# EAGLE design CoffretClimatiquePCBV3 (EAGLE 6.4)
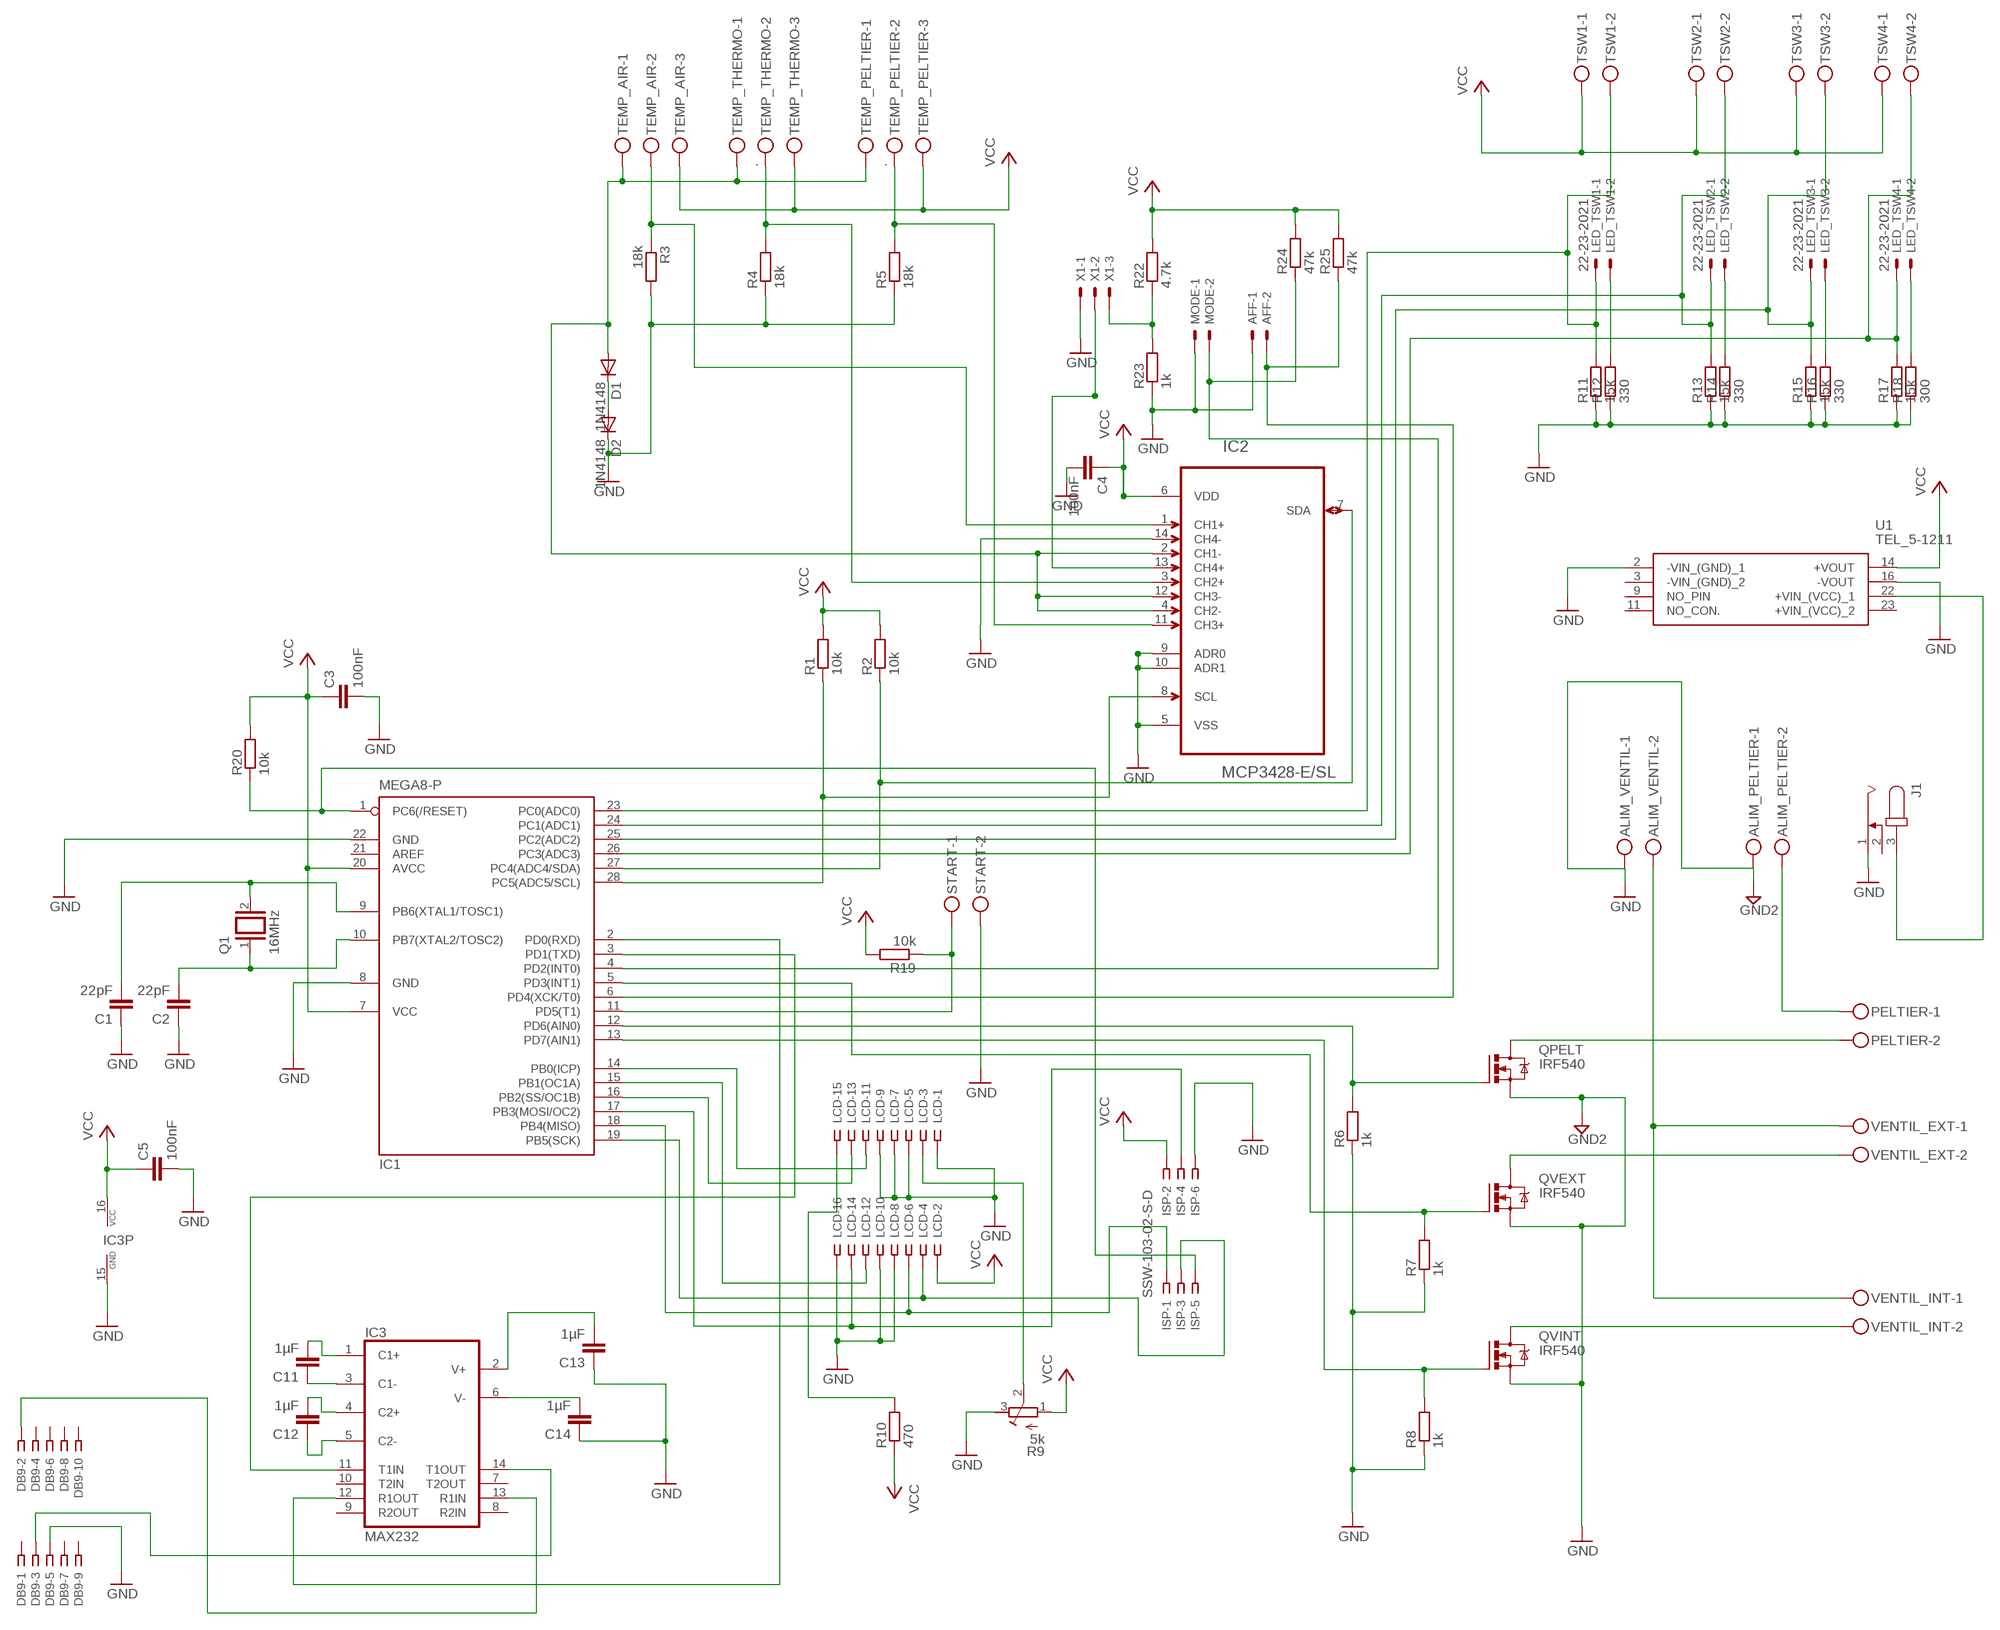
[diagram p0: schematic, sheet 1]

## Parts
AFF  22-23-2021  [22-23-2021]
ALIM_PELTIER  MKDSN1,5/2-5,08  [MKDSN1,5/2-5,08]
ALIM_VENTIL  MKDSN1,5/2-5,08  [MKDSN1,5/2-5,08]
C1  22pF  C-EU075-032X103  [C075-032X103]
C2  22pF  C-EU075-032X103  [C075-032X103]
C3  100nF  C-EUC1206  [C1206]
C4  100nF  C-EUC1206  [C1206]
C5  100nF  C-EUC1206  [C1206]
C11  1µF  C-EUC1206  [C1206]
C12  1µF  C-EUC1206  [C1206]
C13  1µF  C-EUC1206  [C1206]
C14  1µF  C-EUC1206  [C1206]
D1  1N4148  1N4148DO35-10  [DO35-10]
D2  1N4148  1N4148DO35-10  [DO35-10]
DB9  SSW-105-02-S-D  [SSW-105-02-S-D]
IC1  MEGA8-P  [DIL28-3]
IC2  MCP3428-E/SL  [SOIC127P600X175-14N]
IC3  MAX232  [DIL16]
ISP  SSW-103-02-S-D  [SSW-103-02-S-D]
J1  JACK-PLUG1  [SPC4078]
LCD  SSW-108-02-S-D  [SSW-108-02-S-D]
LED_TSW1  22-23-2021  [22-23-2021]
LED_TSW2  22-23-2021  [22-23-2021]
LED_TSW3  22-23-2021  [22-23-2021]
LED_TSW4  22-23-2021  [22-23-2021]
MODE  22-23-2021  [22-23-2021]
PELTIER  MKDSN1,5/2-5,08  [MKDSN1,5/2-5,08]
Q1  16MHz  XTAL/S  [QS]
QPELT  IRF540  [TO220BV]
QVEXT  IRF540  [TO220BV]
QVINT  IRF540  [TO220BV]
R1  10k  R-EU_R0805  [R0805]
R2  10k  R-EU_R0805  [R0805]
R3  18k  R-EU_0207/10  [0207/10]
R4  18k  R-EU_0207/10  [0207/10]
R5  18k  R-EU_0207/10  [0207/10]
R6  1k  R-EU_0207/10  [0207/10]
R7  1k  R-EU_0207/10  [0207/10]
R8  1k  R-EU_0207/10  [0207/10]
R9  5k  R-TRIMM64P  [RTRIM64P]
R10  470  R-EU_0207/10  [0207/10]
R11  15k  R-EU_0207/10  [0207/10]
R12  330  R-EU_0207/10  [0207/10]
R13  15k  R-EU_0207/10  [0207/10]
R14  330  R-EU_0207/10  [0207/10]
R15  15k  R-EU_0207/10  [0207/10]
R16  330  R-EU_0207/10  [0207/10]
R17  15k  R-EU_0207/10  [0207/10]
R18  300  R-EU_0207/10  [0207/10]
R19  10k  R-EU_0207/10  [0207/10]
R20  10k  R-EU_0207/10  [0207/10]
R22  4.7k  R-EU_0207/10  [0207/10]
R23  1k  R-EU_0207/10  [0207/10]
R24  47k  R-EU_0207/10  [0207/10]
R25  47k  R-EU_0207/10  [0207/10]
START  MKDSN1,5/2-5,08  [MKDSN1,5/2-5,08]
TEMP_AIR  MKDSN1,5/3-5,08  [MKDSN1,5/3-5,08]
TEMP_PELTIER  .  MKDSN1,5/3-5,08  [MKDSN1,5/3-5,08]
TEMP_THERMO  .  MKDSN1,5/3-5,08  [MKDSN1,5/3-5,08]
TSW1  MKDSN1,5/2-5,08  [MKDSN1,5/2-5,08]
TSW2  MKDSN1,5/2-5,08  [MKDSN1,5/2-5,08]
TSW3  MKDSN1,5/2-5,08  [MKDSN1,5/2-5,08]
TSW4  MKDSN1,5/2-5,08  [MKDSN1,5/2-5,08]
U1  TEL_5-1211  [TEL-5-1211]
VENTIL_EXT  MKDSN1,5/2-5,08  [MKDSN1,5/2-5,08]
VENTIL_INT  MKDSN1,5/2-5,08  [MKDSN1,5/2-5,08]
X1  22-23-2031  [22-23-2031]

## Nets
GND: AFF.1 ALIM_PELTIER.1 ALIM_VENTIL.1 C1.1 C2.1 C3.2 C4.2 C5.2 C13.1 C14.1 D2.C DB9.5 IC1.8(GND) IC1.22(GND) IC2.5(VSS) IC2.9(ADR0) IC2.10(ADR1) IC2.14(CH4-) IC3.15(GND) ISP.6 J1.1 LCD.1 LCD.5 LCD.7 LCD.8 LCD.9 LCD.10 LCD.16 MODE.1 QPELT.S QVEXT.S QVINT.S R3.2 R4.1 R5.1 R6.1 R7.1 R8.1 R9.3(E) R11.1 R12.1 R13.1 R14.1 R15.1 R16.1 R17.1 R18.1 R23.1 START.2 U1.2(-VIN_(GND)_1) U1.16(-VOUT) X1.1 ; supply symbol labelled GND2
N$1: C1.2 IC1.9(PB6(XTAL1/TOSC1)) Q1.2
N$2: C2.2 IC1.10(PB7(XTAL2/TOSC2)) Q1.1
N$3: J1.3 U1.22(+VIN_(VCC)_1)
N$4 [PWR]: QVEXT.D VENTIL_EXT.2
N$5: IC1.27(PC4(ADC4/SDA)) IC2.7(SDA) R2.1
N$6: IC1.28(PC5(ADC5/SCL)) IC2.8(SCL) R1.1
N$7: D1.C D2.A
N$8 [PWR]: ALIM_PELTIER.2 PELTIER.1
N$9: IC2.1(CH1+) R3.1 TEMP_AIR.2
N$10: IC2.3(CH2+) R4.2 TEMP_THERMO.2
N$11: IC2.11(CH3+) R5.2 TEMP_PELTIER.2
N$12: D1.A IC2.2(CH1-) IC2.4(CH2-) IC2.12(CH3-) TEMP_AIR.1 TEMP_PELTIER.1 TEMP_THERMO.1
N$13: IC2.13(CH4+) X1.2
N$14 [PWR]: PELTIER.2 QPELT.D
N$15: ALIM_VENTIL.2 VENTIL_EXT.1 VENTIL_INT.1
N$16: IC1.12(PD6(AIN0)) QPELT.G R6.2
N$17: IC1.5(PD3(INT1)) QVEXT.G R7.2
N$18: IC1.3(PD1(TXD)) IC3.11(T1IN)
N$19: QVINT.D VENTIL_INT.2
N$20: DB9.2 IC3.13(R1IN)
N$21: LCD.3 R9.2(S)
N$22: DB9.3 IC3.14(T1OUT)
N$23: LCD.15 R10.2
N$25: R22.1 R23.2 X1.3
N$30: IC1.4(PD2(INT0)) MODE.2 R24.1
N$31: AFF.2 IC1.6(PD4(XCK/T0)) R25.1
N$36: IC1.11(PD5(T1)) R19.1 START.1
N$37: IC1.2(PD0(RXD)) IC3.12(R1OUT)
N$38: IC1.13(PD7(AIN1)) QVINT.G R8.2
N$39: IC1.23(PC0(ADC0)) LED_TSW1.1 R11.2 TSW1.2
N$40: IC1.19(PB5(SCK)) ISP.3 LCD.4
N$41: IC1.24(PC1(ADC1)) LED_TSW2.1 R13.2 TSW2.2
N$42: IC1.18(PB4(MISO)) ISP.1 LCD.6
N$43: IC1.25(PC2(ADC2)) LED_TSW3.1 R15.2 TSW3.2
N$44: IC1.14(PB0(ICP)) LCD.11
N$45: IC1.26(PC3(ADC3)) LED_TSW4.1 R17.2 TSW4.2
N$46: IC1.15(PB1(OC1A)) LCD.12
N$47: IC1.16(PB2(SS/OC1B)) LCD.13
N$48: LED_TSW1.2 R12.2
N$49: LED_TSW2.2 R14.2
N$50: LED_TSW3.2 R16.2
N$51: LED_TSW4.2 R18.2
N$52: IC1.17(PB3(MOSI/OC2)) ISP.4 LCD.14
N$53: IC1.1(PC6(/RESET)) ISP.5 R20.1
N$54: C11.2 IC3.1(C1+)
N$55: C11.1 IC3.3(C1-)
N$56: C12.2 IC3.4(C2+)
N$57: C12.1 IC3.5(C2-)
N$58: C14.2 IC3.6(V-)
N$59: C13.2 IC3.2(V+)
VCC: C3.1 C4.1 C5.1 IC1.7(VCC) IC1.20(AVCC) IC2.6(VDD) IC3.16(VCC) ISP.2 LCD.2 R1.2 R2.2 R9.1(A) R10.1 R19.2 R20.2 R22.2 R24.2 R25.2 TEMP_AIR.3 TEMP_PELTIER.3 TEMP_THERMO.3 TSW1.1 TSW2.1 TSW3.1 TSW4.1 U1.14(+VOUT)
Unconnected: DB9.1 DB9.4 DB9.6 DB9.7 DB9.8 DB9.9 DB9.10 IC1.21(AREF) IC3.7(T2OUT) IC3.8(R2IN) IC3.9(R2OUT) IC3.10(T2IN) J1.2 U1.3(-VIN_(GND)_2) U1.9(NO_PIN) U1.11(NO_CON.) U1.23(+VIN_(VCC)_2)

## Library data of the parts
AFF LED_TSW1-LED_TSW4 MODE = con-molex:22-23-2021: .100" (2.54mm) Center Header - 2 Pin; MF: MOLEX; MPN: 22-23-2021; OC_FARNELL: 1462926; OC_NEWARK: 25C3832
ALIM_PELTIER ALIM_VENTIL PELTIER START TSW1-TSW4 VENTIL_EXT VENTIL_INT = con-phoenix-508:MKDSN1,5/2-5,08: MKDSN 1,5/ 2-5,08 Printklemme Nennstrom: 13,5 A Nennspannung: 250 V Rastermaß: 5,08 mm Polzahl: 2 Anschlussart: Schraubanschluss Montage: Löten Anschlussrichtung Leiter/Platine: 0 ° Artikelnummer: 1729128 Source: http://eshop.phoenixcontact.com .. 1729128.pdf; MPN: MKDSN 1,5/2-5.08; OC_FARNELL: 1792903; OC_NEWARK: 30M2397
C1-C5 C11-C14 = rcl:C-EU: CAPACITOR, European symbol
D1 D2 = diode:1N4148: DIODE high speed (Philips)
DB9 = con-samtec:SSW-105-02-S-D: THROUGH-HOLE .025" SQ POST SOCKET Source: Samtec SSW.pdf; MPN: SSW-105-02-S-D; OC_FARNELL: unknown; OC_NEWARK: 11P9398
IC1 = atmel:MEGA8-P: MICROCONTROLLER 8 Kbytes FLASH, 1 kbytes SRAM, 512 bytes EEPROM, USART, 4-channel 10 bit ADC, 2-channel 8 bit ADC Pin compatible with Atmega48, ATMega88, ATMega168 Source: avr.lbr; OC_FARNELL: unknown; OC_NEWARK: unknown
IC2 = Microchip_By_element14_Batch_1:MCP3428-E/SL: Analog-to-Digital Converter; MPN: MCP3428-E/SL; OC_FARNELL: 1825014; OC_NEWARK: 52R9962; PACKAGE: SOIC-14; SUPPLIER: Microchip
IC3 = maxim:MAX232: RS232 TRANSEIVER; MF: MAXIM; MPN: MAX232ACPE+; OC_FARNELL: 9723773; OC_NEWARK: 68K4544
ISP = con-samtec:SSW-103-02-S-D: THROUGH-HOLE .025" SQ POST SOCKET Source: Samtec SSW.pdf; MPN: SSW-103-02-S-D; OC_FARNELL: unknown; OC_NEWARK: 11P9365
J1 = con-jack:JACK-PLUG: DC POWER JACK Power Jack, DC, Right Angle, Through Hole, Rated 5A at 16VDC, PC Terminals Distributor: Farnell (www.Farnell.de) Drawing: 84N1161.pdf / 84N1162.pdf Manufacturer: SPC Technology (www.spctechnology.com) Type: SPC4077 / SPC 4078; OC_FARNELL: unknown; OC_NEWARK: unknown
LCD = con-samtec:SSW-108-02-S-D: THROUGH-HOLE .025" SQ POST SOCKET Source: Samtec SSW.pdf; MPN: SSW-108-02-S-D; OC_FARNELL: unknown; OC_NEWARK: 85K7646
Q1 = special:XTAL/S: CRYSTAL
QPELT QVEXT QVINT = transistor-power:IRF540: HEXFET Power MOSFET
R1-R8 R10-R20 R22-R25 = rcl:R-EU_: RESISTOR, European symbol
R9 = rcl:R-TRIMM: Trimm resistor
TEMP_AIR TEMP_PELTIER TEMP_THERMO = con-phoenix-508:MKDSN1,5/3-5,08: MKDSN 1,5/ 3-5,08 Printklemme Nennstrom: 13,5 A Nennspannung: 250 V Rastermaß: 5,08 mm Polzahl: 3 Anschlussart: Schraubanschluss Montage: Löten Anschlussrichtung Leiter/Platine: 0 ° Artikelnummer: 1729131 Source: http://eshop.phoenixcontact.com .. 1729131.pdf; MPN: SMKDSN1,5/3-5,08; OC_FARNELL: 1792904; OC_NEWARK: 70R0299
U1 = TEL_5-1211:TEL_5-1211: TEL5 DC-DC converter,9-18Vin 5V 5W TRACOPOWER Isolated DC-DC Converter, Vin 9 18 V dc, Vout 5V dc, I/O isolation 1500V dc Source: Datasheet <http://assets.tracopower.com/20170802134720/TEL5/documents/tel5-datasheet.pdf>; ALLIED_NUMBER: 70421183; ALLIED_PRICE-STOCK: https://www.alliedelec.com/tracopower-tel-5-1211/70421183/; DESCRIPTION: TEL5 DC-DC converter,9-18Vin 5V 5W TRACOPOWER Isolated DC-DC Converter, Vin 9 18 V dc, Vout 5V dc, I/O isolation 1500V dc; HEIGHT: mm; MANUFACTURER_NAME: Traco Power; MANUFACTURER_PART_NUMBER: TEL 5-1211; MOUSER_PART_NUMBER: 495-TEL-5-1211; MOUSER_PRICE-STOCK: https://www.mouser.com/Search/Refine.aspx?Keyword=495-TEL-5-1211; RS_PART_NUMBER: 4667051; RS_PRICE-STOCK: https://uk.rs-online.com/web/p/products/4667051
X1 = con-molex:22-23-2031: .100" (2.54mm) Center Header - 3 Pin; MF: MOLEX; MPN: 22-23-2031; OC_FARNELL: 1462950; OC_NEWARK: 30C0862

## Net classes
1 PWR: width 2 mm

## Board
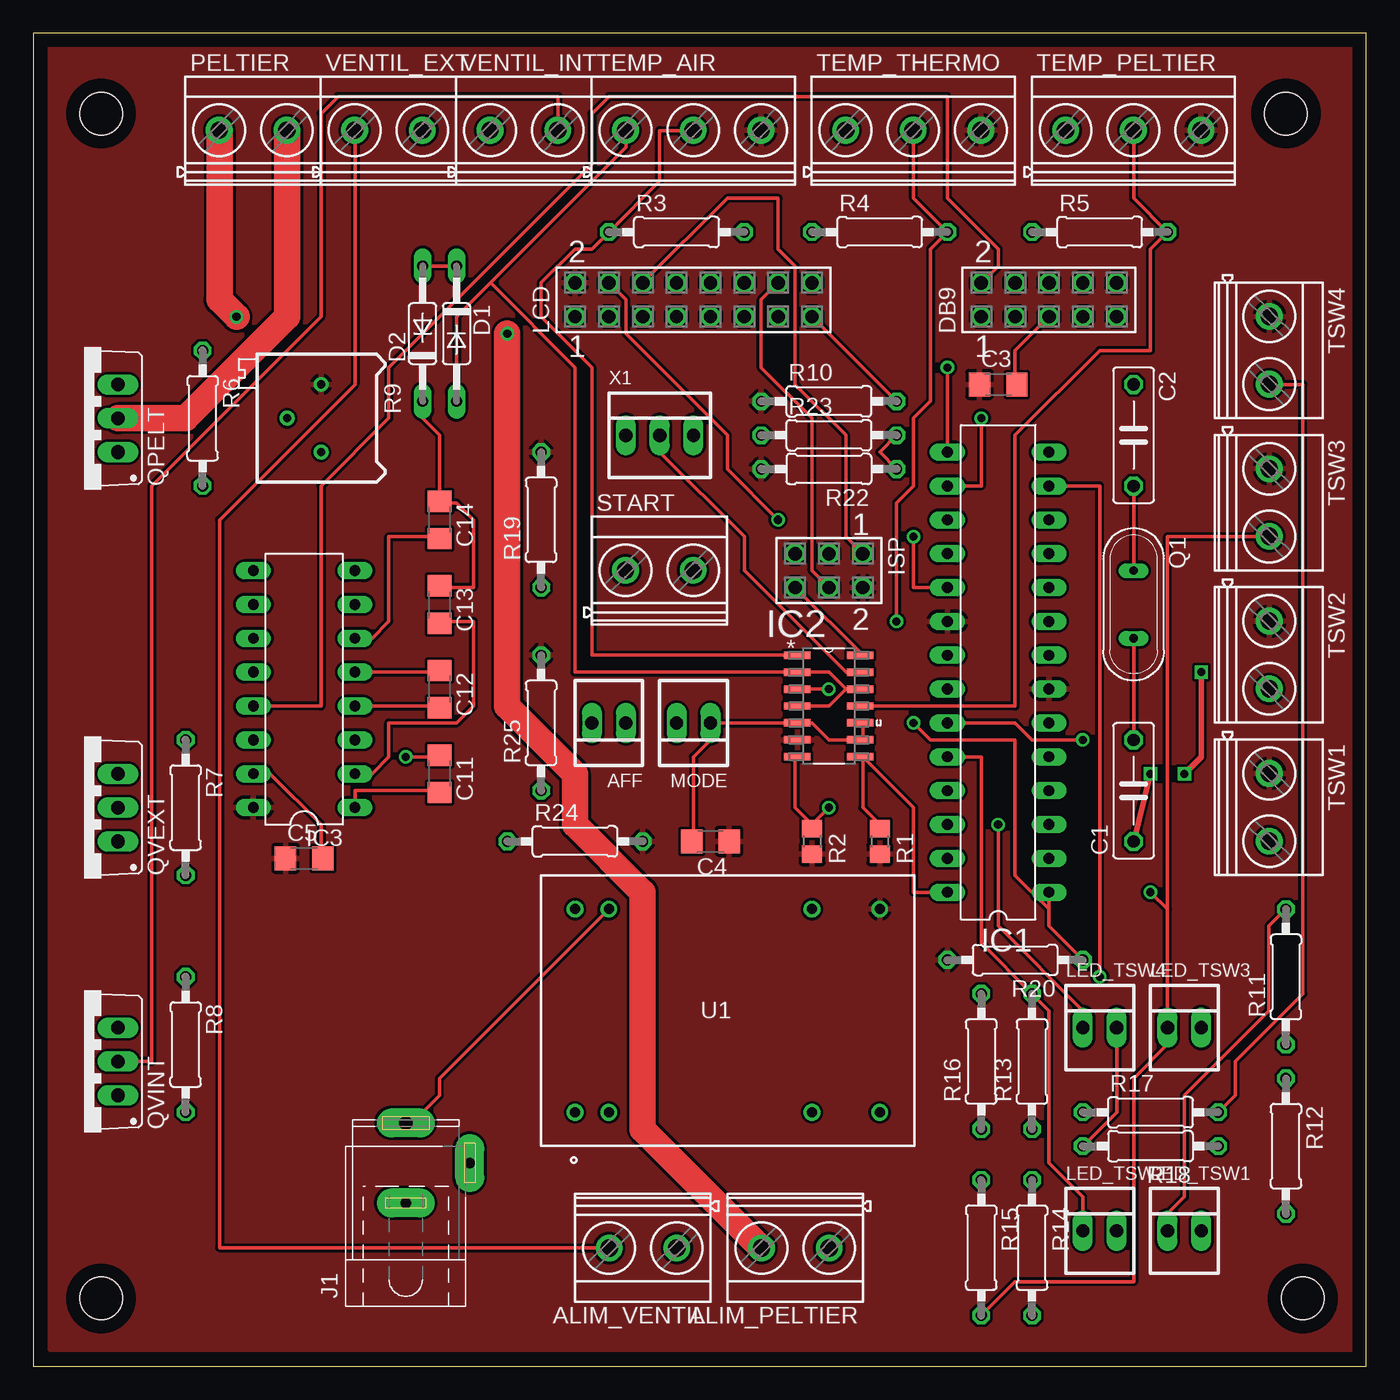
[diagram p1: board, top side]
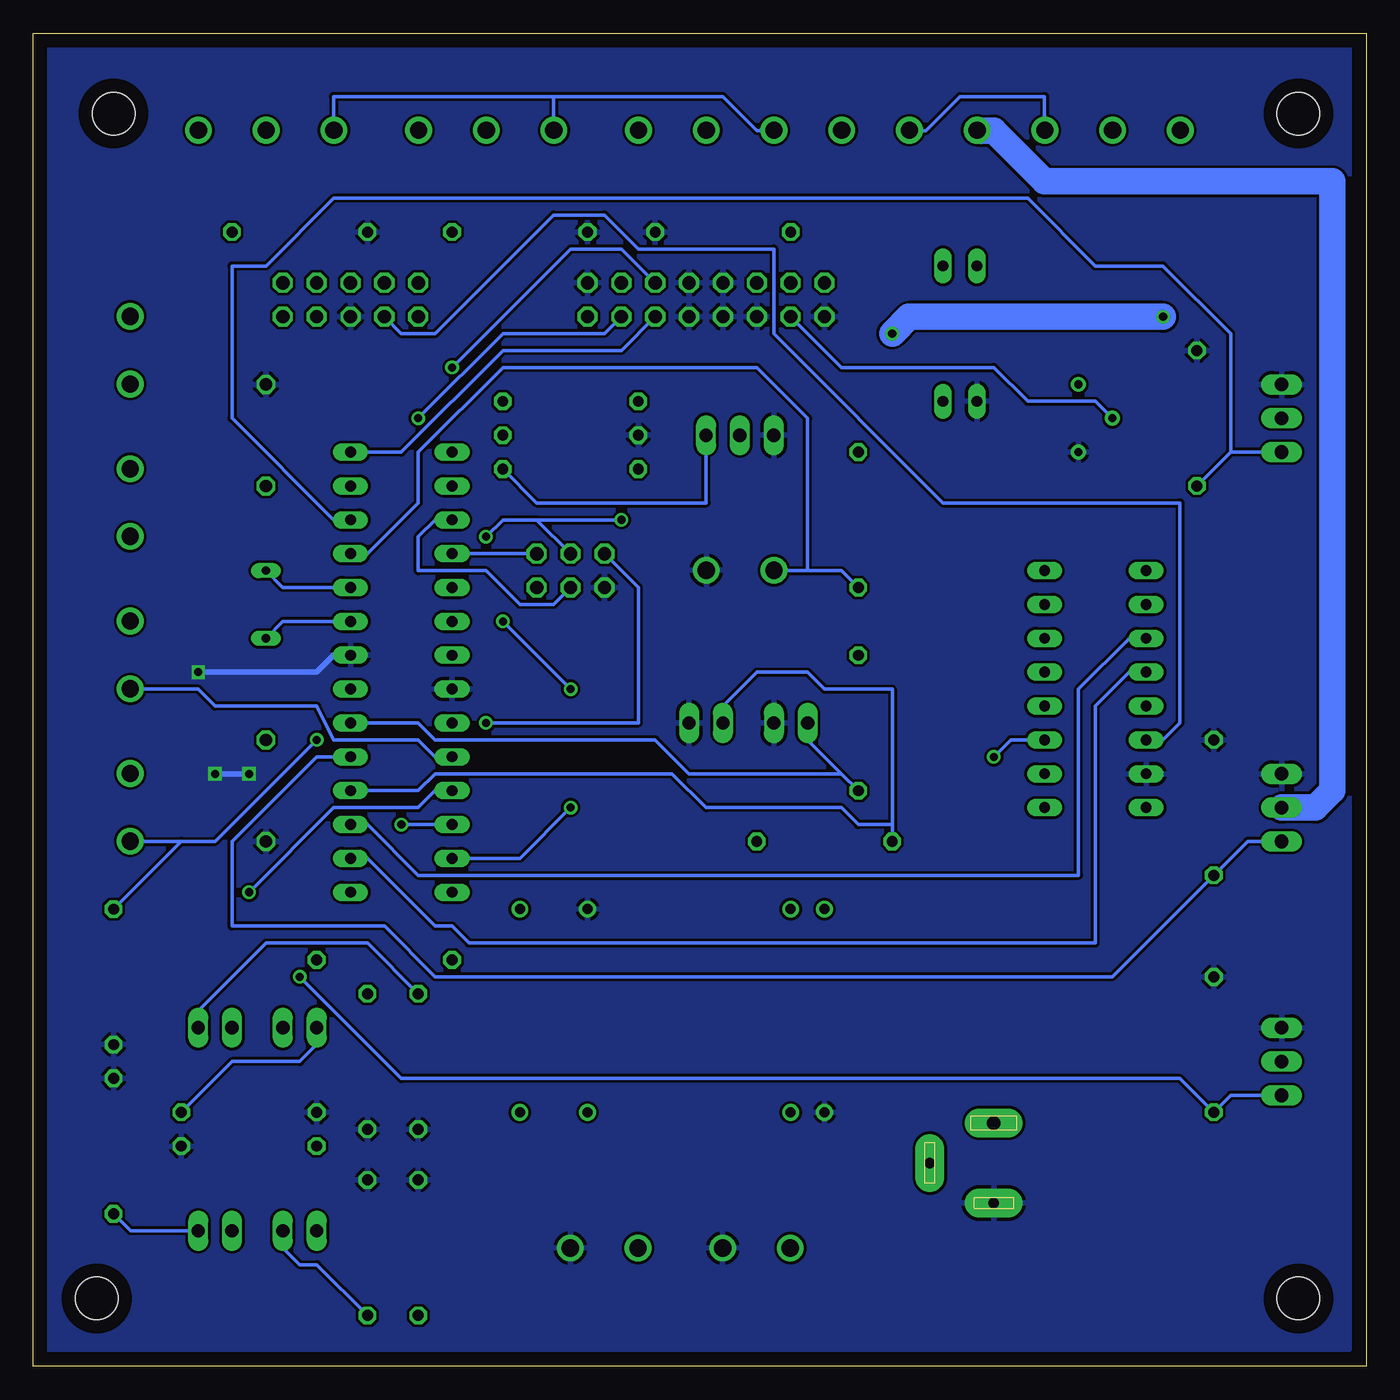
[diagram p2: board, bottom side, seen from below]

Size 100 x 100 mm. Coordinates in mm from the lower left corner, seen from the top.
Outline: 0,0 100,0 100,100 0,100 0,0
Copper layers (1*16): Top 0.035mm / dielectric 1.5mm / Bottom 0.035mm
Design rules "default *": minimum track width 10mil, minimum drill 24mil, track to track 8mil, track to pad 8mil, pad to pad 8mil, via to via 8mil, smd to smd 8mil, copper to edge 40mil, drill to drill 8mil, minimum pad ring 10mil, minimum via ring 8mil, stop-mask expansion 4mil, vias tented up to drill 0mil, thermal gap 10mil
Holes 3.2 mm at 95.25,5.08 5.08,5.08 93.98,93.98 5.08,93.98

### Footprints (pad centres in the part's own frame; a part is rotated, then mirrored left to right if it is on the bottom)
22-23-2021 = drill 1 long: 1 -1.27,0; 2 1.27,0
MKDSN1,5/2-5,08 = drill 1.3 pad 2: 1 -2.561,0.025; 2 2.519,0.025
C075-032X103 = drill 0.914 octagon: 1 -3.81,0; 2 3.81,0
C1206 = smd 1.6 x 1.8: 1 -1.4,0; 2 1.4,0
DO35-10 = drill 0.813 long: A 5.08,0; C -5.08,0
SSW-105-02-S-D = drill 1 pad 1.5 octagon: 1 -5.08,-1.27; 2 -5.08,1.27; 3 -2.54,-1.27; 4 -2.54,1.27; 5 0,-1.27; 6 0,1.27; 7 2.54,-1.27; 8 2.54,1.27; 9 5.08,-1.27; 10 5.08,1.27
DIL28-3 = drill 0.813 long: 1 -16.51,-3.81; 2 -13.97,-3.81; 3 -11.43,-3.81; 4 -8.89,-3.81; 5 -6.35,-3.81; 6 -3.81,-3.81; 7 -1.27,-3.81; 8 1.27,-3.81; 9 3.81,-3.81; 10 6.35,-3.81; 11 8.89,-3.81; 12 11.43,-3.81; 13 13.97,-3.81; 14 16.51,-3.81; 15 16.51,3.81; 16 13.97,3.81; 17 11.43,3.81; 18 8.89,3.81; 19 6.35,3.81; 20 3.81,3.81; 21 1.27,3.81; 22 -1.27,3.81; 23 -3.81,3.81; 24 -6.35,3.81; 25 -8.89,3.81; 26 -11.43,3.81; 27 -13.97,3.81; 28 -16.51,3.81
SOIC127P600X175-14N = smd 1.981 x 0.559: 1 -2.362,3.81; 2 -2.362,2.54; 3 -2.362,1.27; 4 -2.362,0; 5 -2.362,-1.27; 6 -2.362,-2.54; 7 -2.362,-3.81; 8 2.362,-3.81; 9 2.362,-2.54; 10 2.362,-1.27; 11 2.362,0; 12 2.362,1.27; 13 2.362,2.54; 14 2.362,3.81
DIL16 = drill 0.813 long: 1 -8.89,-3.81; 2 -6.35,-3.81; 3 -3.81,-3.81; 4 -1.27,-3.81; 5 1.27,-3.81; 6 3.81,-3.81; 7 6.35,-3.81; 8 8.89,-3.81; 9 8.89,3.81; 10 6.35,3.81; 11 3.81,3.81; 12 1.27,3.81; 13 -1.27,3.81; 14 -3.81,3.81; 15 -6.35,3.81; 16 -8.89,3.81
SSW-103-02-S-D = drill 1 pad 1.5 octagon: 1 -2.54,-1.27; 2 -2.54,1.27; 3 0,-1.27; 4 0,1.27; 5 2.54,-1.27; 6 2.54,1.27
SPC4078 = drill 0.8 pad 2.184 long: 1 -3,0; 2 0,-4.8 | drill 1 pad 2.184 long: 3 3,0
SSW-108-02-S-D = drill 1 pad 1.5 octagon: 1 -8.89,-1.27; 2 -8.89,1.27; 3 -6.35,-1.27; 4 -6.35,1.27; 5 -3.81,-1.27; 6 -3.81,1.27; 7 -1.27,-1.27; 8 -1.27,1.27; 9 1.27,-1.27; 10 1.27,1.27; 11 3.81,-1.27; 12 3.81,1.27; 13 6.35,-1.27; 14 6.35,1.27; 15 8.89,-1.27; 16 8.89,1.27
QS = drill 0.61 long: 1 -2.54,0; 2 2.54,0
TO220BV = drill 1.016 long: D 0,-2.54; G -2.54,-2.54; S 2.54,-2.54
R0805 = smd 1.3 x 1.5: 1 -0.95,0; 2 0.95,0
0207/10 = drill 0.813 octagon: 1 -5.08,0; 2 5.08,0
RTRIM64P = drill 0.61: 1 0,-2.54; 2 2.54,0; 3 0,2.54
MKDSN1,5/3-5,08 = drill 1.3 pad 2: 1 -7.641,0.025; 2 -2.561,0.025; 3 2.519,0.025
TEL-5-1211 = drill 0.75 pad 1.25: 2 2.54,-7.62; 3 5.08,-7.62; 9 20.32,-7.62; 11 25.4,-7.62; 14 25.4,7.62; 16 20.32,7.62; 22 5.08,7.62; 23 2.54,7.62
22-23-2031 = drill 1 long: 1 -2.54,0; 2 0,0; 3 2.54,0

### Placement (x,y rotation side)
AFF  43.18,48.26 180 top
ALIM_PELTIER  57.15,8.89 180 top
ALIM_VENTIL  45.72,8.89 180 top
C1  82.55,43.18 90 top
C2  82.55,69.85 270 top
C3  72.39,73.66 0 top
C4  50.8,39.37 180 top
C5  20.32,38.1 0 top
C11  30.48,44.45 270 top
C12  30.48,50.8 270 top
C13  30.48,57.15 270 top
C14  30.48,63.5 270 top
D1  31.75,77.47 270 top
D2  29.21,77.47 90 top
DB9  76.2,80.01 0 top
IC1  72.39,52.07 90 top
IC2  59.69,49.53 0 top
IC3  20.32,50.8 90 top
ISP  59.69,59.69 180 top
J1  27.94,15.24 90 top
LCD  49.53,80.01 0 top
LED_TSW1  86.36,10.16 0 top
LED_TSW2  80.01,10.16 0 top
LED_TSW3  86.36,25.4 0 top
LED_TSW4  80.01,25.4 0 top
MODE  49.53,48.26 180 top
PELTIER  16.51,92.71 0 top
Q1  82.55,57.15 270 top
QPELT  3.81,71.12 90 top
QVEXT  3.81,41.91 90 top
QVINT  3.81,22.86 90 top
R1  63.5,39.37 270 top
R2  58.42,39.37 270 top
R3  48.26,85.09 0 top
R4  63.5,85.09 0 top
R5  80.01,85.09 0 top
R6  12.7,71.12 270 top
R7  11.43,41.91 270 top
R8  11.43,24.13 270 top
R9  21.59,71.12 180 top
R10  59.69,72.39 0 top
R11  93.98,29.21 90 top
R12  93.98,16.51 270 top
R13  74.93,22.86 90 top
R14  74.93,8.89 270 top
R15  71.12,8.89 270 top
R16  71.12,22.86 90 top
R17  83.82,19.05 0 top
R18  83.82,16.51 180 top
R19  38.1,63.5 90 top
R20  73.66,30.48 180 top
R22  59.69,67.31 180 top
R23  59.69,69.85 0 top
R24  40.64,39.37 0 top
R25  38.1,48.26 90 top
START  46.99,59.69 0 top
TEMP_AIR  52.07,92.71 0 top
TEMP_PELTIER  85.09,92.71 0 top
TEMP_THERMO  68.58,92.71 0 top
TSW1  92.71,41.91 270 top
TSW2  92.71,53.34 270 top
TSW3  92.71,64.77 270 top
TSW4  92.71,76.2 270 top
U1  38.1,26.67 0 top
VENTIL_EXT  26.67,92.71 0 top
VENTIL_INT  36.83,92.71 0 top
X1  46.99,69.85 0 top

### Tracks (layer width: path | path; a pad name or v marks a point on that pad's centre or on a via)
GND  (via drill 0.6)
  Top 0.254: C13.1 30.48,58.42 33.02,58.42 33.02,63.5 31.75,64.77 30.48,64.77 C14.1 30.48,69.85 29.21,71.12 D2.C | IC2.10 62.23,48.26 62.23,46.99 IC2.9 59.69,46.99 58.42,48.26 IC2.5 MODE.1 50.8,46.99 49.53,45.72 49.53,39.37 C4.2 | IC3.15 17.78,44.45 21.59,40.64 21.59,38.1 C5.2 | DB9.5 73.66,76.2 73.66,73.66 C3.2 | ISP.6 62.23,53.34 IC2.14
  Top 0.406: C1.1 v83.82,44.45 | v86.36,44.45 87.63,45.72 v87.63,52.07
  Bottom 0.406: v83.82,44.45 v86.36,44.45 | v87.63,52.07 78.74,52.07 77.47,53.34 IC1.8
  pour Bottom: 1.27,99.06 99.06,99.06 99.06,1.27 1.27,1.27
N$1
  Top 0.254: Q1.2 C1.2
  Bottom 0.254: Q1.2 81.28,55.88 IC1.9
N$2
  Top 0.254: Q1.1 C2.2
  Bottom 0.254: Q1.1 81.28,58.42 IC1.10
N$3
  Top 0.254: U1.22 30.48,21.59 30.48,20.32 27.94,17.78 J1.3
N$4
  Bottom 2: QVEXT.D 3.81,41.91 2.54,43.18 2.54,88.9 24.13,88.9 27.94,92.71 29.21,92.71 VENTIL_EXT.2
N$5  (via drill 0.61)
  Top 0.254: 58.42,40.64 57.15,41.91 57.15,45.72 IC2.7 | 58.42,40.64 v59.69,41.91 | 58.42,40.64 R2.1
  Bottom 0.254: IC1.27 63.5,38.1 v59.69,41.91
N$6
  Top 0.254: 62.23,45.72 62.23,41.91 63.5,40.64 R1.1 | IC1.28 66.04,35.56 66.04,41.91 62.23,45.72 | 62.23,45.72 IC2.8
N$7
  Top 0.254: D1.C D2.A
N$8  (via drill 0.61)
  Top 2: v35.56,77.47 35.56,49.53 40.64,44.45 40.64,40.64 45.72,35.56 45.72,17.78 54.61,8.89 ALIM_PELTIER.2 | v15.24,78.74 13.97,80.01 13.97,92.71 PELTIER.1
  Bottom 2: v35.56,77.47 34.29,78.74 v15.24,78.74
N$9
  Top 0.254: IC2.1 41.91,53.34 41.91,74.93 38.1,78.74 38.1,81.28 40.64,83.82 41.91,83.82 R3.1 46.99,88.9 46.99,92.71 49.53,92.71 TEMP_AIR.2
N$10  (via drill 0.61)
  Top 0.254: v59.69,50.8 IC2.3 57.15,50.8 | v64.77,55.88 64.77,64.77 66.04,66.04 66.04,71.12 67.31,72.39 67.31,83.82 R4.2 66.04,87.63 66.04,92.71 TEMP_THERMO.2
  Bottom 0.254: v64.77,55.88 v59.69,50.8
N$11
  Top 0.254: IC2.11 73.66,49.53 73.66,69.85 80.01,76.2 83.82,76.2 83.82,83.82 R5.2 82.55,87.63 82.55,92.71 TEMP_PELTIER.2
N$12
  Top 0.254: 60.96,50.8 59.69,49.53 IC2.4 57.15,49.53 | 60.96,50.8 IC2.12 62.23,50.8 | 60.96,50.8 59.69,52.07 IC2.2 57.15,52.07 40.64,52.07 40.64,74.93 34.29,81.28 | D1.A 31.75,78.74 34.29,81.28 | 34.29,81.28 44.45,91.44 44.45,92.71 TEMP_AIR.1
  Bottom 0.254: 60.96,95.25 60.96,92.71 TEMP_THERMO.1 | 60.96,95.25 48.26,95.25 45.72,92.71 44.45,92.71 TEMP_AIR.1 | 60.96,95.25 77.47,95.25 77.47,92.71 TEMP_PELTIER.1
N$13
  Top 0.254: X1.2 46.99,68.58 53.34,62.23 53.34,59.69 60.96,52.07 IC2.13 62.23,52.07
N$14
  Top 2: QPELT.D 11.43,71.12 19.05,78.74 19.05,92.71 PELTIER.2
N$15
  Top 0.254: ALIM_VENTIL.2 43.18,8.89 13.97,8.89 13.97,63.5 24.13,73.66 24.13,92.71 VENTIL_EXT.1
  Bottom 0.254: VENTIL_EXT.1 24.13,92.71 24.13,95.25 30.48,95.25 33.02,92.71 34.29,92.71 VENTIL_INT.1
N$16
  Bottom 0.254: 10.16,68.58 R6.2 | QPELT.G 10.16,68.58 | IC1.12 77.47,63.5 85.09,71.12 85.09,82.55 82.55,82.55 77.47,87.63 25.4,87.63 20.32,82.55 15.24,82.55 10.16,77.47 10.16,68.58
N$17
  Bottom 0.254: QVEXT.G 8.89,39.37 R7.2 19.05,29.21 69.85,29.21 73.66,33.02 85.09,33.02 85.09,39.37 78.74,45.72 IC1.5
N$18
  Bottom 0.254: IC3.11 17.78,54.61 21.59,50.8 21.59,36.83 71.12,36.83 74.93,40.64 IC1.3
N$19
  Top 0.254: QVINT.D 8.89,22.86 8.89,66.04 21.59,78.74 21.59,93.98 22.86,95.25 39.37,95.25 39.37,92.71 VENTIL_INT.2
N$20
  Top 0.254: IC3.13 21.59,49.53 21.59,66.04 26.67,71.12 26.67,74.93 41.91,90.17 41.91,93.98 43.18,95.25 68.58,95.25 68.58,87.63 72.39,83.82 72.39,82.55 DB9.2
N$21
  Bottom 0.254: R9.2 20.32,72.39 25.4,72.39 27.94,74.93 39.37,74.93 LCD.3
N$22
  Bottom 0.254: IC3.14 15.24,46.99 13.97,48.26 13.97,64.77 31.75,64.77 44.45,77.47 44.45,83.82 54.61,83.82 57.15,86.36 60.96,86.36 69.85,77.47 72.39,77.47 DB9.3
N$23
  Top 0.254: LCD.15 R10.2
N$25
  Top 0.254: R22.1 63.5,68.58 R23.2
  Bottom 0.254: X1.3 49.53,64.77 62.23,64.77 R22.1
N$30
  Bottom 0.254: 35.56,40.64 35.56,50.8 40.64,50.8 41.91,52.07 45.72,52.07 48.26,49.53 MODE.2 | 35.56,40.64 R24.1 | IC1.4 71.12,43.18 69.85,44.45 52.07,44.45 49.53,41.91 39.37,41.91 38.1,40.64 35.56,40.64
N$31
  Bottom 0.254: 39.37,44.45 41.91,46.99 AFF.2 | 39.37,44.45 R25.1 | IC1.6 71.12,48.26 69.85,46.99 53.34,46.99 50.8,44.45 39.37,44.45
N$36
  Bottom 0.254: R19.1 39.37,59.69 41.91,59.69 | 41.91,59.69 44.45,59.69 START.1 | IC1.11 74.93,60.96 71.12,64.77 71.12,68.58 64.77,74.93 45.72,74.93 41.91,71.12 41.91,59.69
N$37
  Bottom 0.254: IC3.12 17.78,52.07 20.32,49.53 20.32,31.75 67.31,31.75 68.58,33.02 69.85,33.02 74.93,38.1 IC1.2
N$38  (via drill 0.61)
  Top 0.254: IC1.13 80.01,66.04 v80.01,29.21
  Bottom 0.254: QVINT.G 10.16,20.32 R8.2 13.97,21.59 72.39,21.59 v80.01,29.21
N$39  (via drill 0.61)
  Top 0.254: IC1.23 73.66,48.26 74.93,46.99 v78.74,46.99 | LED_TSW1.1 85.09,11.43 86.36,12.7 86.36,20.32 92.71,26.67 92.71,33.02 R11.2
  Bottom 0.254: v78.74,46.99 86.36,39.37 88.9,39.37 | 88.9,39.37 92.71,39.37 TSW1.2 | 88.9,39.37 R11.2
N$40  (via drill 0.61)
  Top 0.254: IC1.19 66.04,58.42 v66.04,62.23 | LCD.4 44.45,80.01 44.45,77.47 52.07,69.85 52.07,67.31 v55.88,63.5
  Bottom 0.254: v66.04,62.23 64.77,63.5 62.23,63.5 | ISP.3 62.23,63.5 | 62.23,63.5 v55.88,63.5
N$41
  Top 0.254: LED_TSW2.1 78.74,12.7 76.2,15.24 76.2,26.67 R13.2 71.12,31.75 71.12,45.72 IC1.24
  Bottom 0.254: IC1.24 69.85,45.72 71.12,46.99 77.47,46.99 78.74,49.53 86.36,49.53 87.63,50.8 92.71,50.8 TSW2.2
N$42
  Top 0.254: LCD.6 52.07,87.63 55.88,87.63 55.88,83.82 57.15,82.55 57.15,73.66 60.96,69.85 60.96,62.23 ISP.1
  Bottom 0.254: ISP.1 IC1.18
N$43  (via drill 0.61)
  Top 0.254: R15.2 73.66,6.35 82.55,6.35 82.55,21.59 85.09,24.13 LED_TSW3.1 85.09,34.29 | 85.09,34.29 v83.82,35.56 | 85.09,34.29 85.09,62.23 92.71,62.23 TSW3.2
  Bottom 0.254: IC1.25 69.85,43.18 71.12,41.91 77.47,41.91 v83.82,35.56
N$44
  Bottom 0.254: IC1.14 72.39,68.58 64.77,76.2 55.88,76.2 LCD.11
N$45  (via drill 0.61)
  Top 0.254: v72.39,40.64 72.39,33.02 78.74,26.67 LED_TSW4.1 | R17.2 90.17,20.32 90.17,22.86 95.25,27.94 95.25,73.66 92.71,73.66 TSW4.2
  Bottom 0.254: R17.2 85.09,22.86 80.01,22.86 78.74,24.13 LED_TSW4.1 | v72.39,40.64 IC1.26
N$46  (via drill 0.61)
  Top 0.254: v68.58,74.93 IC1.15
  Bottom 0.254: v68.58,74.93 59.69,83.82 55.88,83.82 LCD.12
N$47  (via drill 0.61)
  Top 0.254: IC1.16 71.12,66.04 v71.12,71.12
  Bottom 0.254: v71.12,71.12 64.77,77.47 57.15,77.47 LCD.13
N$48
  Bottom 0.254: R12.2 92.71,10.16 LED_TSW1.2
N$49
  Bottom 0.254: R14.2 78.74,7.62 80.01,7.62 81.28,8.89 LED_TSW2.2
N$50
  Bottom 0.254: R16.2 74.93,31.75 82.55,31.75 87.63,26.67 LED_TSW3.2
N$51
  Top 0.254: R18.2 81.28,19.05 LED_TSW4.2
N$52
  Top 0.254: LCD.14 54.61,80.01 54.61,74.93 58.42,71.12 58.42,59.69 ISP.4
  Bottom 0.254: IC1.17 69.85,63.5 71.12,62.23 71.12,59.69 66.04,59.69 63.5,57.15 60.96,57.15 ISP.4
N$53  (via drill 0.61)
  Top 0.254: R20.1 76.2,33.02 76.2,34.29 | IC1.1 76.2,34.29 | v66.04,48.26 67.31,46.99 73.66,46.99 73.66,36.83 76.2,34.29
  Bottom 0.254: ISP.5 54.61,58.42 54.61,48.26 v66.04,48.26
N$54
  Top 0.254: IC3.1 24.13,43.18 30.48,43.18 C11.2
N$55  (via drill 0.61)
  Top 0.254: v27.94,45.72 30.48,45.72 C11.1
  Bottom 0.254: v27.94,45.72 26.67,46.99 IC3.3
N$56
  Top 0.254: IC3.4 30.48,49.53 C12.2
N$57
  Top 0.254: IC3.5 30.48,52.07 C12.1
N$58
  Top 0.254: IC3.6 25.4,54.61 26.67,55.88 26.67,62.23 30.48,62.23 C14.2
N$59
  Top 0.254: IC3.2 25.4,44.45 26.67,45.72 26.67,48.26 31.75,48.26 33.02,49.53 33.02,55.88 30.48,55.88 C13.2
VCC
  pour Top: 1.27,99.06 99.06,99.06 99.06,1.27 1.27,1.27

### Text on the board
Document: +++ | --- | +++ | --- | +++ | --- | GND | VCC | GND | VCC | GND | VCC | GND | GND